# EAGLE design MotoDriver (EAGLE 7.3.0)
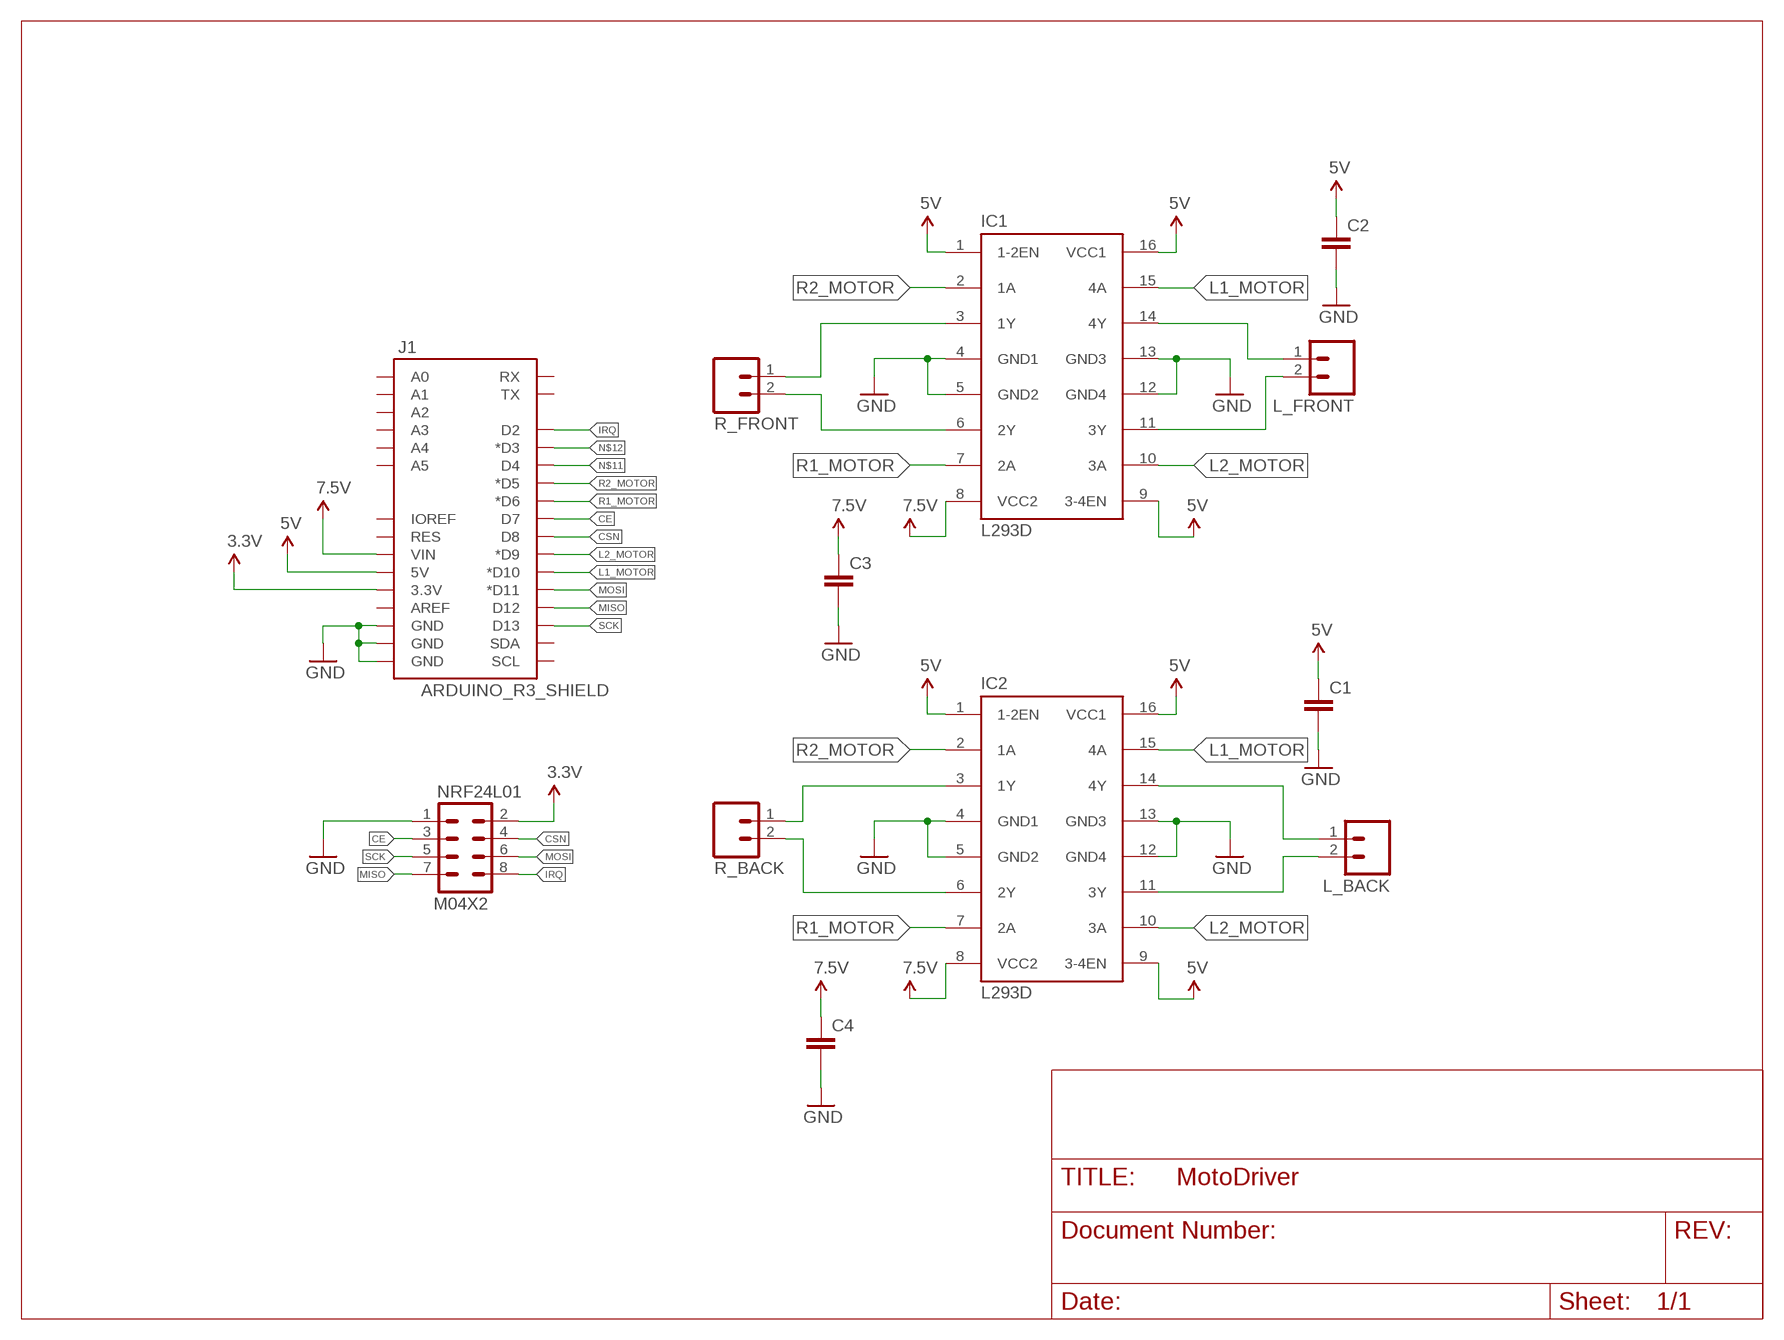
[diagram p0: schematic, sheet 1]

## Parts
C1  C-EU050-024X044  [C050-024X044]
C2  C-EU050-024X044  [C050-024X044]
C3  C-EU050-024X044  [C050-024X044]
C4  C-EU050-024X044  [C050-024X044]
IC1  L293D  [DIL16]
IC2  L293D  [DIL16]
J1  ARDUINO_R3_SHIELD  [UNO_R3_SHIELD]
L_BACK  M021X02_NO_SILK  [1X02_NO_SILK]
L_FRONT  M021X02_NO_SILK  [1X02_NO_SILK]
NRF24L01  M04X2  [2X4]
R_BACK  M021X02_NO_SILK  [1X02_NO_SILK]
R_FRONT  M021X02_NO_SILK  [1X02_NO_SILK]

## Nets
3.3V: J1.3.3V NRF24L01.2
5V: C1.1 C2.1 IC1.1(1-2EN) IC1.9(3-4EN) IC1.16(VCC1) IC2.1(1-2EN) IC2.9(3-4EN) IC2.16(VCC1) J1.5V
CE: J1.D7 NRF24L01.3
CSN: J1.D8 NRF24L01.4
GND: C1.2 C2.2 C3.2 C4.2 IC1.4(GND1) IC1.5(GND2) IC1.12(GND4) IC1.13(GND3) IC2.4(GND1) IC2.5(GND2) IC2.12(GND4) IC2.13(GND3) J1.GND@0(GND) J1.GND@1(GND) J1.GND@2(GND) NRF24L01.1
IRQ: J1.D2 NRF24L01.8
L1_1: IC1.14(4Y) L_FRONT.1
L1_2: IC2.14(4Y) L_BACK.1
L1_MOTOR: IC1.15(4A) IC2.15(4A) J1.D10(*D10)
L2_1: IC1.11(3Y) L_FRONT.2
L2_2: IC2.11(3Y) L_BACK.2
L2_MOTOR: IC1.10(3A) IC2.10(3A) J1.D9(*D9)
MISO: J1.D12 NRF24L01.7
MOSI: J1.D11(*D11) NRF24L01.6
N$11: J1.D4
N$12: J1.D3(*D3)
R1_1: IC1.3(1Y) R_FRONT.1
R1_2: IC2.3(1Y) R_BACK.1
R1_MOTOR: IC1.7(2A) IC2.7(2A) J1.D6(*D6)
R2_1: IC1.6(2Y) R_FRONT.2
R2_2: IC2.6(2Y) R_BACK.2
R2_MOTOR: IC1.2(1A) IC2.2(1A) J1.D5(*D5)
SCK: J1.D13 NRF24L01.5
V_BATT: C3.1 C4.1 IC1.8(VCC2) IC2.8(VCC2) J1.VIN ; supply symbol labelled 7.5V
Unconnected: J1.A0 J1.A1 J1.A2 J1.A3 J1.A4 J1.A5 J1.AREF J1.IOREF J1.RES J1.RX J1.SCL J1.SDA J1.TX

## Library data of the parts
C1-C4 = resistor:C-EU: CAPACITOR, European symbol
IC1 IC2 = st-microelectronics:L293D: PUSH-PULL 4 CHANNEL DRIVER; MPN: L293D; OC_FARNELL: 9589619; OC_NEWARK: 56P8249
J1 = SparkFun-Boards:ARDUINO_R3_SHIELD: Shield form compatible with the Arduino Uno R3.
L_BACK L_FRONT R_BACK R_FRONT = SparkFun-Connectors:M02: Standard 2-pin 0.1" header. Use with - straight break away headers ( PRT-00116) - right angle break away headers (PRT-00553) - swiss pins (PRT-00743) - machine pins (PRT-00117) - female headers (PRT-00115) Molex polarized connector foot print use with: PRT-08233 with associated crimp pins and housings. 2.54_SCREWTERM for use with PRT-10571. 3.5mm Screw Terminal footprints for PRT-08084 5mm Screw Terminal footprints for use with PRT-08432
NRF24L01 = SparkFun-Connectors:M04X2: .1" header, two rows of four.

## Board
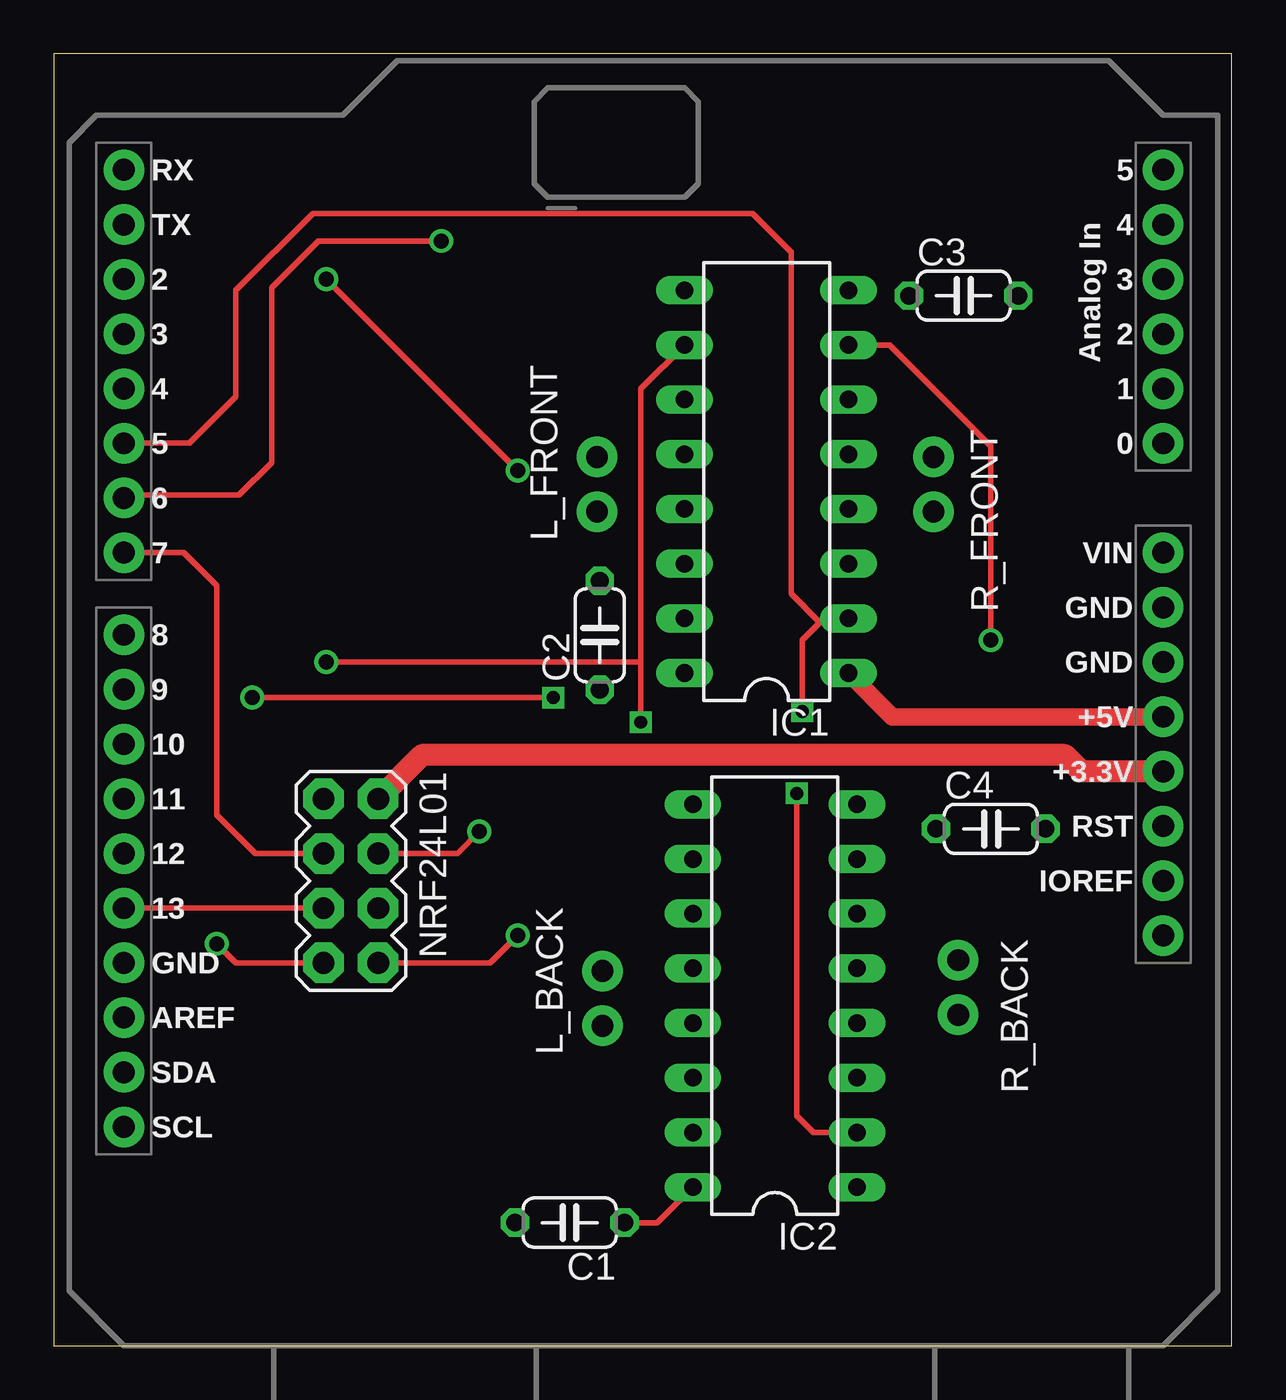
[diagram p1: board, top side]
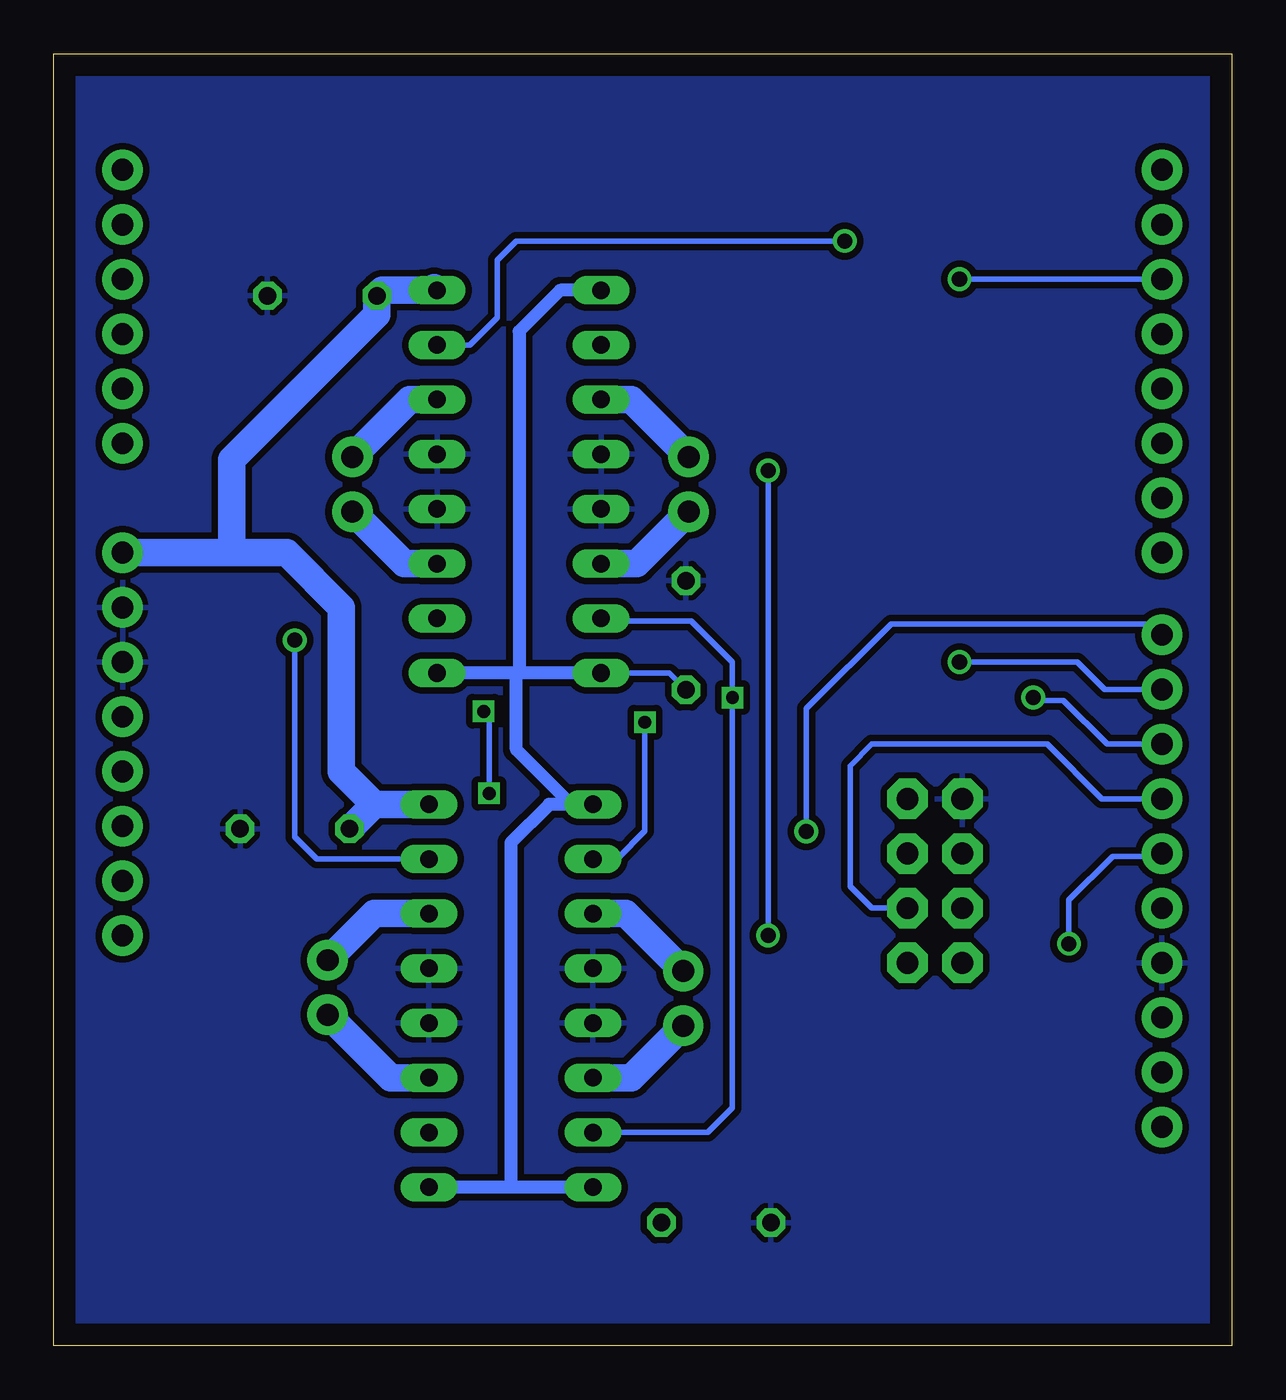
[diagram p2: board, bottom side, seen from below]

Size 54.7 x 60 mm. Coordinates in mm from the lower left corner, seen from the top.
Outline: 0,0 54.7,0 54.7,60 0,60 0,0
Copper layers (1*16): Top 0.035mm / dielectric 1.5mm / Bottom 0.035mm
Design rules "default": minimum track width 10mil, minimum drill 24mil, track to track 8mil, track to pad 8mil, pad to pad 8mil, via to via 8mil, smd to smd 8mil, copper to edge 40mil, drill to drill 8mil, minimum pad ring 10mil, minimum via ring 8mil, stop-mask expansion 4mil, vias tented up to drill 0mil, thermal gap 10mil

### Footprints (pad centres in the part's own frame; a part is rotated, then mirrored left to right if it is on the bottom)
C050-024X044 = drill 0.813 octagon: 1 -2.54,0; 2 2.54,0
DIL16 = drill 0.813 long: 1 -8.89,-3.81; 2 -6.35,-3.81; 3 -3.81,-3.81; 4 -1.27,-3.81; 5 1.27,-3.81; 6 3.81,-3.81; 7 6.35,-3.81; 8 8.89,-3.81; 9 8.89,3.81; 10 6.35,3.81; 11 3.81,3.81; 12 1.27,3.81; 13 -1.27,3.81; 14 -3.81,3.81; 15 -6.35,3.81; 16 -8.89,3.81
UNO_R3_SHIELD = drill 1.016 pad 1.88: 3.3V 50.8,26.67; 5V 50.8,29.21; A0 50.8,41.91; A1 50.8,44.45; A2 50.8,46.99; A3 50.8,49.53; A4 50.8,52.07; A5 50.8,54.61; AREF 2.54,15.24; D2 2.54,49.53; D3 2.54,46.99; D4 2.54,44.45; D5 2.54,41.91; D6 2.54,39.37; D7 2.54,36.83; D8 2.54,33.02; D9 2.54,30.48; D10 2.54,27.94; D11 2.54,25.4; D12 2.54,22.86; D13 2.54,20.32; GND@0 50.8,31.75; GND@1 50.8,34.29; GND@2 2.54,17.78; IOREF 50.8,21.59; NC 50.8,19.05; RES 50.8,24.13; RX 2.54,54.61; SCL 2.54,10.16; SDA 2.54,12.7; TX 2.54,52.07; VIN 50.8,36.83
1X02_NO_SILK = drill 1.016 pad 1.88: 1 0,0; 2 2.54,0
2X4 = drill 1.016 pad 1.88 octagon: 1 -3.81,-1.27; 2 -3.81,1.27; 3 -1.27,-1.27; 4 -1.27,1.27; 5 1.27,-1.27; 6 1.27,1.27; 7 3.81,-1.27; 8 3.81,1.27

### Placement (x,y rotation side)
C1  23.95,5.71 180 top
C2  25.35,32.99 90 top
C3  42.24,48.77 0 top
C4  43.51,24 0 top
IC1  33.09,40.13 90 top
IC2  33.47,16.26 90 top
J1  0.71,0 0 top
L_BACK  25.47,14.86 90 top
L_FRONT  25.22,38.73 90 top
NRF24L01  13.79,21.59 270 top
R_BACK  41.98,15.37 90 top
R_FRONT  40.84,38.73 90 top

### Tracks (layer width: path | path; a pad name or v marks a point on that pad's centre or on a via)
3.3V
  Top 1.016: J1.3.3V 47.7,26.67 46.94,27.43 17.09,27.43 NRF24L01.2
5V
  Top 0.254: C1.1 28.01,5.71 IC2.16
  Top 0.813: J1.5V 38.93,29.21 IC1.1
  Bottom 0.254: IC1.16 26.13,31.24 C2.1
  Bottom 0.61: IC1.16 33.22,31.24 | 33.22,31.24 IC1.1 | IC1.9 31.19,49.02 33.09,47.12 33.09,31.37 33.22,31.24 | IC2.16 33.47,7.37 | 33.47,7.37 IC2.1 | 33.22,31.24 33.22,27.69 30.68,25.15 IC2.9 31.7,25.15 33.47,23.37 33.47,7.37
CE
  Top 0.254: NRF24L01.3 9.34,22.86 7.57,24.64 7.57,35.31 6.04,36.83 J1.D7
CSN  (via drill 0.7)
  Top 0.254: NRF24L01.4 18.74,22.86 v19.76,23.88
  Bottom 0.254: v19.76,23.88 19.76,29.59 15.82,33.53 3.76,33.53 J1.D8
GND
  pour Bottom (isolate 0.305): 54.05,59.82 54.17,0 0.83,-0.13 0.71,59.94
IRQ  (via drill 0.7)
  Top 0.254: NRF24L01.8 20.27,17.78 v21.54,19.05 | v21.54,40.64 v12.65,49.53
  Bottom 0.254: v21.54,19.05 v21.54,40.64 | v12.65,49.53 J1.D2
L1_1
  Bottom 1.27: IC1.14 27.63,36.32 L_FRONT.1
L1_2
  Bottom 1.27: IC2.14 27.89,12.45 L_BACK.1
L1_MOTOR  (via drill 0.6, 0.7)
  Top 0.254: v9.22,30.1 v23.19,30.1
  Bottom 0.254: IC2.15 24.33,9.91 23.19,11.05 v23.19,30.1 23.19,31.75 25.09,33.66 29.16,33.66 IC1.15 | J1.D10 5.79,27.94 7.82,29.97 9.09,29.97 v9.22,30.1
L2_1
  Bottom 1.27: IC1.11 27.89,43.94 L_FRONT.2
L2_2
  Bottom 1.27: IC2.11 28.14,20.07 L_BACK.2
L2_MOTOR  (via drill 0.6, 0.7)
  Top 0.254: 27.25,31.75 27.25,44.45 IC1.10 | v12.65,31.75 27.25,31.75 | 27.25,31.75 v27.25,28.96
  Bottom 0.254: J1.D9 5.91,30.48 7.18,31.75 v12.65,31.75 | v27.25,28.96 27.25,23.9 28.52,22.63 29.64,22.63 IC2.10
  Bottom 0.813: 29.92,46.48 IC1.10
MISO  (via drill 0.7)
  Top 0.254: NRF24L01.7 8.45,17.78 v7.57,18.67
  Bottom 0.254: v7.57,18.67 7.57,20.7 5.53,22.73 3.37,22.73 J1.D12
MOSI
  Bottom 0.254: NRF24L01.6 16.71,20.32 17.73,21.34 17.73,26.92 16.71,27.94 8.58,27.94 6.04,25.4 J1.D11
R1_1
  Bottom 1.27: IC1.3 38.43,36.32 R_FRONT.1
R1_2
  Bottom 1.27: IC2.3 39.06,12.45 R_BACK.1
R1_MOTOR  (via drill 0.6, 0.7)
  Top 0.254: v3.37,39.5 8.58,39.5 10.11,41.02 10.11,49.15 12.26,51.31 v17.98,51.31 | v43.51,32.77 43.51,41.78 38.81,46.48 IC1.7
  Bottom 0.254: IC2.7 42.49,22.61 43.51,23.62 v43.51,32.77 | IC1.7 35.38,46.48 34.11,47.75 34.11,50.42 33.22,51.31 v17.98,51.31 | v3.37,39.5 J1.D6
R2_1
  Bottom 1.27: IC1.6 38.17,43.94 R_FRONT.2
R2_2
  Bottom 1.27: IC2.6 39.82,20.07 R_BACK.2
R2_MOTOR  (via drill 0.6)
  Top 0.254: IC2.2 35.25,9.91 34.49,10.67 v34.49,25.65 | v34.74,29.46 34.74,32.77 35.57,33.59 | 35.57,33.59 35.76,33.78 IC1.2 | J1.D5 6.3,41.91 8.45,44.07 8.45,49.02 12.01,52.58 32.46,52.58 34.24,50.8 34.24,34.92 35.57,33.59
  Bottom 0.254: v34.49,25.65 34.49,29.21 v34.74,29.46
SCK
  Top 0.254: J1.D13 NRF24L01.5
V_BATT
  Bottom 1.27: IC2.8 39.82,25.15 | 39.82,25.15 41.35,26.67 41.35,34.29 43.89,36.83 46.43,36.83 | 46.43,36.83 J1.VIN | 37.03,49.15 IC1.8 39.44,49.02 C3.1 39.7,47.88 46.43,41.15 46.43,36.83 | C4.1 39.82,25.15